# EAGLE design LB_BIT_i7-remoteTrigger_v03(2_2) (EAGLE 6.6.0)
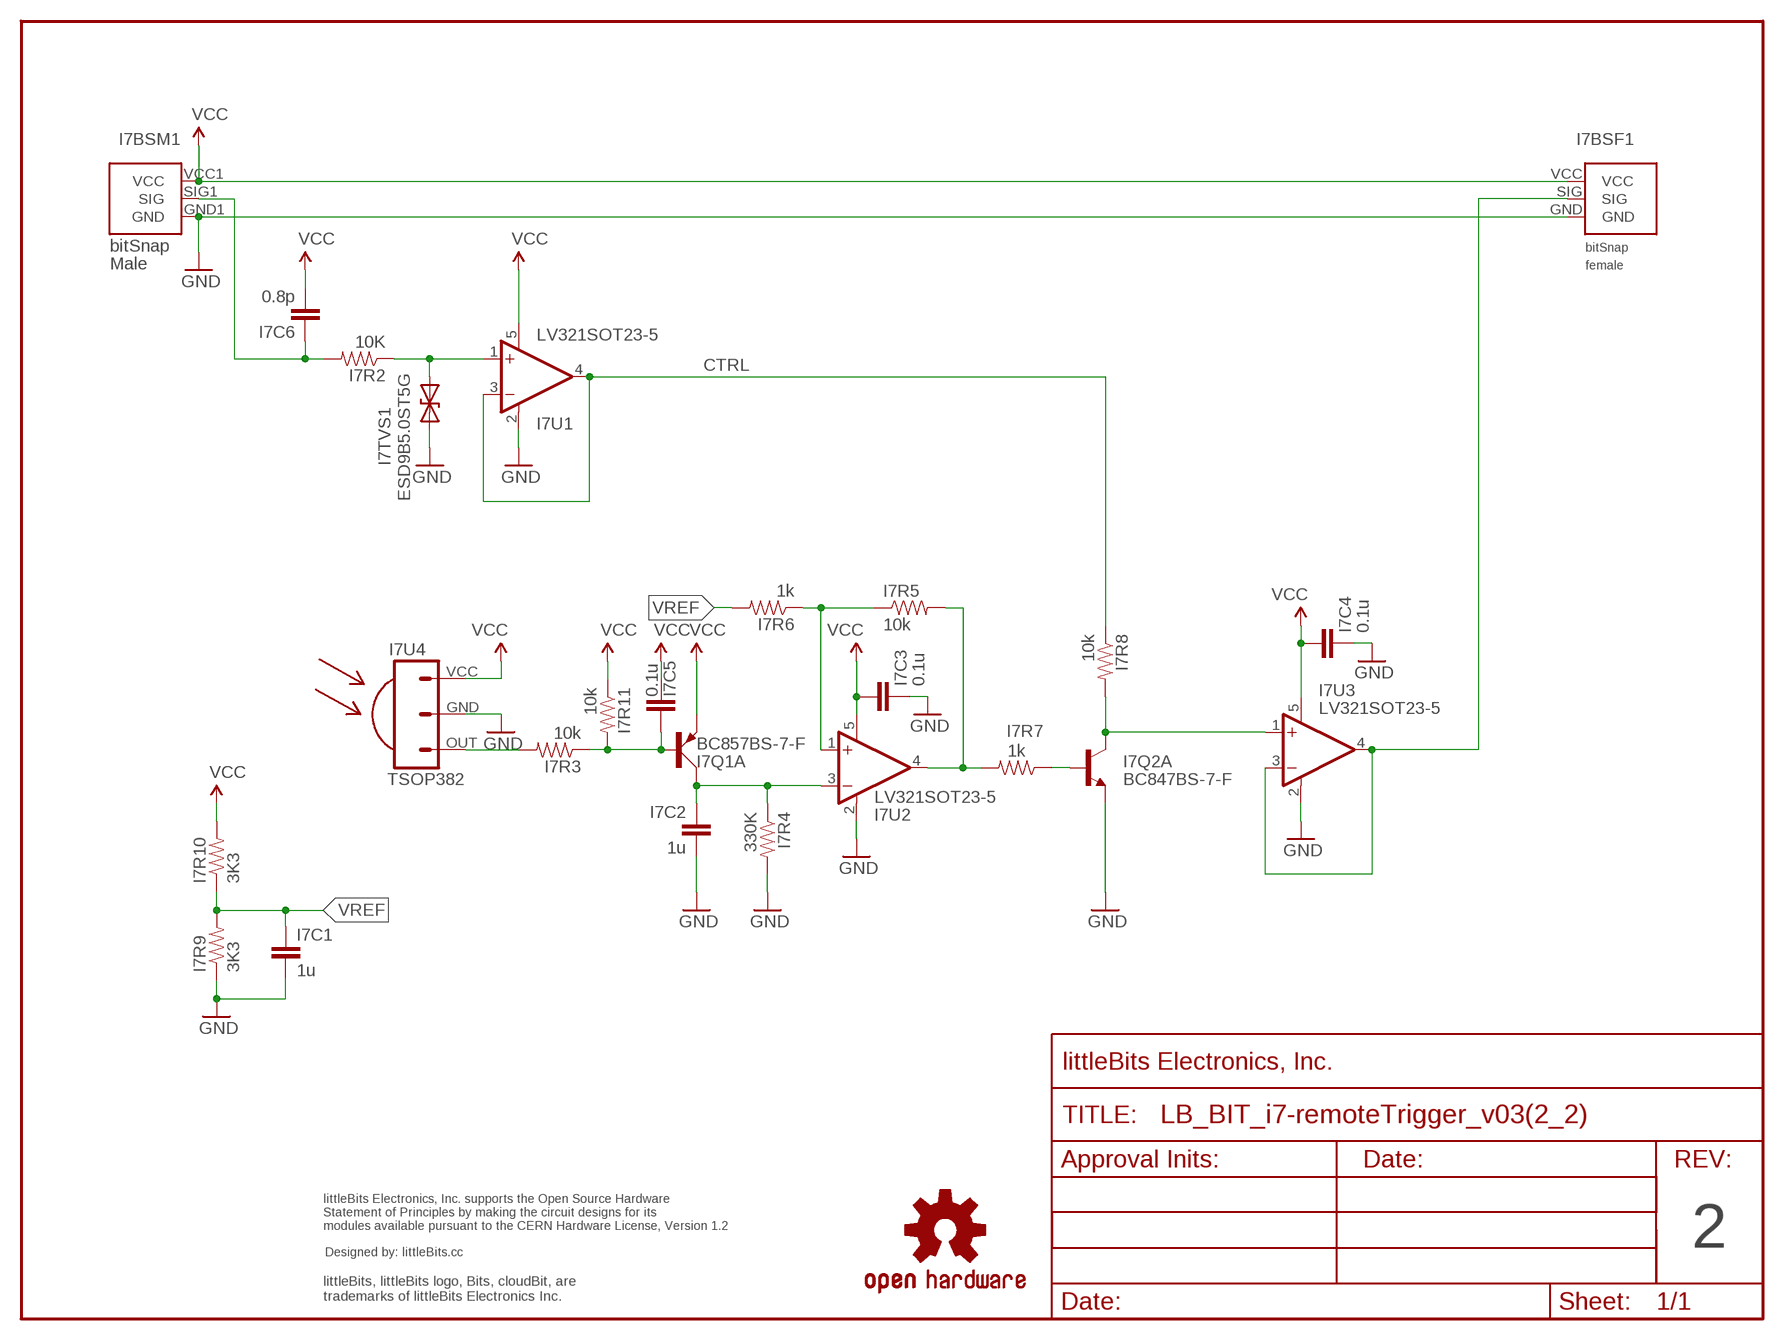
[diagram p0: schematic, sheet 1]

## Parts
I7BSF1  BITSNAP_V03_FEMALE  [BITSNAP_V03_FEMALE]
I7BSM1  BITSNAP_V03_MALE  [BITSNAP_V03_MALE]
I7C1  1u  CAPCAP-0603  [CAP-0603]
I7C2  1u  CAPCAP-0603  [CAP-0603]
I7C3  0.1u  CAPCAP-0603  [CAP-0603]
I7C4  0.1u  CAPCAP-0603  [CAP-0603]
I7C5  0.1u  CAPCAP-0603  [CAP-0603]
I7C6  0.8p  CAPCAP-0603  [CAP-0603]
I7Q1  BC857BS-7-F  TRANS-BJT_PNP-DUALBC857  [SOT-363_PHILLIPS]
I7Q2  BC847BS-7-F  TRANS-BJT_NPN-DUAL-BC847BS  [SOT-363_PHILLIPS]
I7R2  10K  RESISTOR0603  [RES-0603]
I7R3  10k  RESISTOR0603  [RES-0603]
I7R4  330K  RESISTOR0603  [RES-0603]
I7R5  10k  RESISTOR0603  [RES-0603]
I7R6  1k  RESISTOR0603  [RES-0603]
I7R7  1k  RESISTOR0603  [RES-0603]
I7R8  10k  RESISTOR0603  [RES-0603]
I7R9  3K3  RESISTOR0603  [RES-0603]
I7R10  3K3  RESISTOR0603  [RES-0603]
I7R11  10k  RESISTOR0603  [RES-0603]
I7TVS1  ESD9B5.0ST5G  DIODE-TVSSOD-923  [SOD-923]
I7U1  LV321SOT23-5  [SOT23-5]
I7U2  LV321SOT23-5  [SOT23-5]
I7U3  LV321SOT23-5  [SOT23-5]
I7U4  TSOP382  TSOP38238-IR-RECEIVER-MODULE  [IR-RECEIVER-TSOP382-THRU-HOLE]
U$2  OSHWCREDIT  [OSHWCREDIT]
U$3  OSHW-LOGOL  [OSHW-LOGO-L]
U$21  FRAME-LETTER-OHWOHW  [FABDWG01-OHW]

## Nets
CTRL: I7R8.1 I7U1.3(-IN) I7U1.4(OUT)
GND: I7BSF1.GND I7BSM1.GND1(GND) I7C1.2 I7C2.2 I7C3.1 I7C4.1 I7Q2.1(A:E) I7R4.2 I7R9.1 I7TVS1.1(A) I7U1.2(V-) I7U2.2(V-) I7U3.2(V-) I7U4.GND
N$1: I7R5.2 I7R7.2 I7U2.4(OUT)
N$2: I7C5.2 I7Q1.2(A:B) I7R3.1 I7R11.2
N$3: I7C2.1 I7Q1.6(A:C) I7R4.1 I7U2.3(-IN)
N$4: I7R5.1 I7R6.1 I7U2.1(+IN)
N$5: I7Q2.2(A:B) I7R7.1
N$6: I7R3.2 I7U4.OUT
N$7: I7Q2.6(A:C) I7R8.2 I7U3.1(+IN)
N$8: I7R2.1 I7TVS1.2(C) I7U1.1(+IN)
N$9: I7BSM1.SIG1(SIG) I7C6.1 I7R2.2
N$10: I7BSF1.SIG I7U3.3(-IN) I7U3.4(OUT)
VCC: I7BSF1.VCC I7BSM1.VCC1(VCC) I7C3.2 I7C4.2 I7C5.1 I7C6.2 I7Q1.1(A:E) I7R10.2 I7R11.1 I7U1.5(V+) I7U2.5(V+) I7U3.5(V+) I7U4.VCC
VREF: I7C1.1 I7R6.2 I7R9.2 I7R10.1
Unconnected: I7Q1.3(B:C) I7Q1.4(B:E) I7Q1.5(B:B) I7Q2.3(B:C) I7Q2.4(B:E) I7Q2.5(B:B)

## Notes on the sheet
- 2

## Library data of the parts
I7BSF1 = bitSnap:BITSNAP_V03_FEMALE
I7BSM1 = bitSnap:BITSNAP_V03_MALE
I7C1-I7C6 = LITTLEBITS:CAP
I7Q1 = LITTLEBITS:TRANS-BJT_PNP-DUAL
I7Q2 = LITTLEBITS:TRANS-BJT_NPN-DUAL
I7R2-I7R11 = LITTLEBITS:RESISTOR
I7TVS1 = LITTLEBITS:DIODE-TVS: Bidirectional Transient Voltage Suppression Diode: Device conducts in avalanche mode after reaching a part dependent voltage threshold. Used for limiting voltage spikes on ESD sensitive inputs and outputs.; IEC_ESD_PROT0: +/-18kV; LB_PN: ?; MPN: ESD9B5.0ST5G; V_CLAMP: ?; V_OPERATION: 5V
I7U1-I7U3 = LITTLEBITS:LV321
I7U4 = LITTLEBITS:TSOP38238-IR-RECEIVER-MODULE: IR receiver module from Vishay. Mfg. Part number: TSOP38238SS1V and Mouser Part number: 782-TSOP38238SS1V
U$2 = LITTLEBITS:OSHWCREDIT
U$3 = LITTLEBITS:OSHW-LOGO: Open Source Hardware Logo This logo indicates the piece of hardware it is found on incorporates a OSHW license and/or adheres to the definition of open source hardware found here: http://freedomdefined.org/OSHW
U$21 = LITTLEBITS:FRAME-LETTER-OHW

## Board
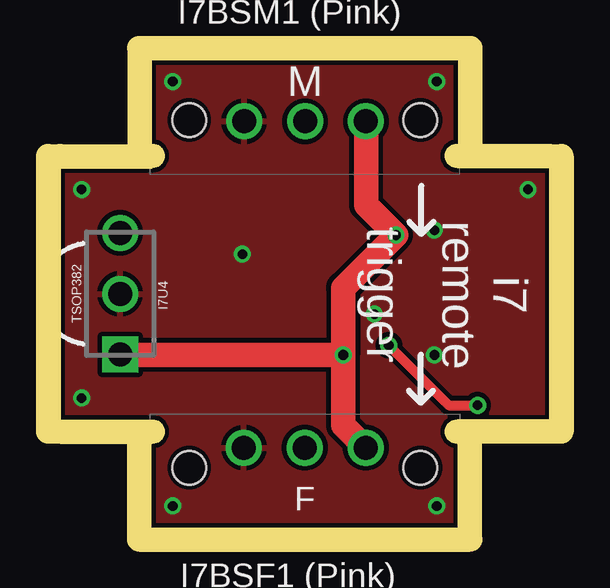
[diagram p1: board, top side]
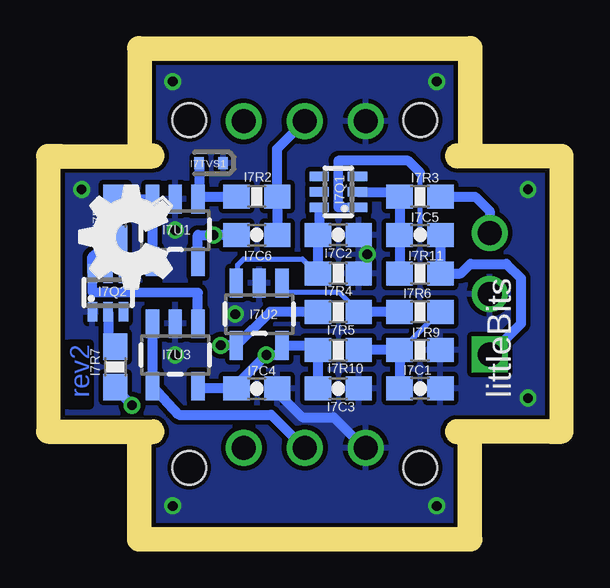
[diagram p2: board, bottom side, seen from below]

Size 20.4 x 19.5 mm. Coordinates in mm from the lower left corner, seen from the top.
Outline: 0,15 0,4.5
Outline: 20.4,4.5 20.4,15
Copper layers (1*16): Top 0.035mm / dielectric 1.5mm / Bottom 0.035mm
Design rules "littleBitsDRC": minimum track width 0.2mm, minimum drill 0.4mm, track to track 0.2mm, track to pad 0.2mm, pad to pad 0.2mm, via to via 0.2mm, smd to smd 0mil, copper to edge 0.2mm, drill to drill 0.2mm, minimum pad ring 0.2mm, minimum via ring 0.15mm, stop-mask expansion 0.1mm, vias tented up to drill 0mil, thermal gap 0.2mm
Milling: 6 lines

### Footprints (pad centres in the part's own frame; a part is rotated, then mirrored left to right if it is on the bottom)
BITSNAP_V03_FEMALE = drill 1: GND 3.91,3.33; SIG 6.45,3.33; VCC 8.99,3.33 | hole 1.4: 1.63,2.5; 11.27,2.5
BITSNAP_V03_MALE = drill 1: GND1 8.98,2.56; SIG1 6.44,2.56; VCC1 3.9,2.56 | hole 1.4: 11.27,2.5; 1.63,2.5
CAP-0603 = smd 1.1 x 1: 1 -0.85,0; 2 0.85,0
SOT-363_PHILLIPS = smd 0.4 x 0.8: 1 -0.65,-0.8; 2 0,-0.8; 3 0.65,-0.8; 4 0.65,0.8; 5 0,0.8; 6 -0.65,0.8
RES-0603 = smd 1.1 x 1: 1 -0.85,0; 2 0.85,0
SOD-923 = smd 0.4 x 0.5: 1 -0.5,0; 2 0.5,0
SOT23-5 = smd 0.55 x 1.2: 1 -0.95,-1.3; 2 0,-1.3; 3 0.95,-1.3; 4 0.95,1.3; 5 -0.95,1.3
IR-RECEIVER-TSOP382-THRU-HOLE = drill 1: GND 0,0; OUT 2.54,0 | drill 1 square: VCC -2.54,0

### Placement (x,y rotation side)
I7BSF1  3.75,0 0 top
I7BSM1  16.65,19.5 180 top
I7C1  5.4,5.8 0 bottom
I7C2  8.8,12.2 0 bottom
I7C3  8.8,5.8 180 bottom
I7C4  12.2,5.8 180 bottom
I7C5  5.4,12.2 180 bottom
I7C6  12.2,12.2 180 bottom
I7Q1  8.8,14 90 bottom
I7Q2  18.4,9.8 0 bottom
I7R2  12.2,13.8 0 bottom
I7R3  5.4,13.8 0 bottom
I7R4  8.8,10.6 0 bottom
I7R5  8.8,9 180 bottom
I7R6  5.4,9 0 bottom
I7R7  18.1,6.7 270 bottom
I7R8  18.1,12.9 270 bottom
I7R9  5.4,7.4 180 bottom
I7R10  8.8,7.4 180 bottom
I7R11  5.4,10.6 180 bottom
I7TVS1  14.1,15.2 180 bottom
I7U1  15.6,12.4 180 bottom
I7U2  12.1,8.9 180 bottom
I7U3  15.6,7.2 180 bottom
I7U4  2.5,9.75 90 top
U$2  -91.7,-64.6 0 top  (outside the outline)
U$3  -25.1,-70.9 0 top  (outside the outline)
U$6  [OSHW_FILLX150_NOTEXT]  15.76,9.16 0 top
U$21  0,0 0 top

### Tracks (layer width: path | path; a pad name or v marks a point on that pad's centre or on a via)
CTRL
  Bottom 0.406: I7U1.4 I7U1.3 18.05,13.7 I7R8.1
GND  (via drill 0.41)
  Bottom 0.406: I7C4.1 11.2,5.65 11.3,5.6 10.3,4.6 9,4.6 7.73,3.33 I7BSF1.GND | I7R4.2 7.6,10.95 v7.6,11.4
  other vias: 13.1,8.9 15.6,7.2 15.6,12.4 4.7,0.9 15.7,0.9 15.7,18.6 4.7,18.6 0.9,14.1 0.9,5.4 19.5,14.1
  pour Top: 0.1,19.42 0.1,0.15 20.27,0.15 20.27,19.42
  pour Bottom: 0.1,19.4 20.25,19.4 20.25,0.1 0.1,0.1
N$1  (via drill 0.41)
  Top 0.406: v13.7,7.6 16.2,5.1 v17.4,5.1
  Bottom 0.406: I7R5.2 11.65,9 I7U2.4 v13.7,7.6 | v17.4,5.1 18.1,5.8 I7R7.2
N$2
  Bottom 0.406: I7R11.2 I7C5.2 I7R3.1 6.25,14 I7Q1.2
N$3
  Bottom 0.203: I7U2.3 13,10.5 13,10.95 12.75,11.2 10.3,11.2 9.7,10.6
  Bottom 0.406: I7Q1.6 9.6,12.35 I7C2.1 I7R4.1 9.7,10.6
N$4
  Bottom 0.2: I7R5.1 8.75,9.8 11.1,9.8
  Bottom 0.203: 11.1,9.8 11.1,10.2
  Bottom 0.406: I7R6.1 I7R5.1 | 11.1,10.2 I7U2.1
N$5
  Bottom 0.406: I7Q2.2 18.4,7.85 I7R7.1
N$6
  Bottom 0.406: I7R3.2 3.1,13.8 2.5,13.2 I7U4.OUT
N$7
  Bottom 0.4: 14.65,9.8 19,9.8 arc90 19.05,9.85 I7Q2.6
  Bottom 0.406: I7Q2.6 19.05,11.3 I7R8.2 | I7U3.1 14.65,9.8
N$8
  Bottom 0.406: I7R2.1 14.55,13.8 I7U1.1 arc-90 14.6,13.75 I7TVS1.2
N$9
  Bottom 0.406: I7C6.1 I7R2.2 11.35,15.8 I7BSM1.SIG1
N$10
  Bottom 0.406: I7U3.3 I7U3.4 15.45,4.7 11.6,4.7 10.3,3.4 I7BSF1.SIG
VCC  (via drill 0.41)
  Top 0.406: I7U4.VCC
  Top 1.016: I7BSM1.VCC1 12.75,13.45 v14,12.2 11.8,10 v11.8,7.2 | I7BSF1.VCC 11.8,4.27 v11.8,7.2 | v11.8,7.2 I7U4.VCC
  Bottom 0.2: I7C5.1 5.4,12.2 5.4,14.8
  Bottom 0.4: 8.8,15.3 8.8,13.35 I7Q1.1
  Bottom 0.406: I7C3.2 I7R10.2 9.85,7.6 I7U2.5 11.15,7.2 v11.8,7.2 13.05,5.95 I7C4.2 14.65,5.8 I7U3.5 | I7C5.1 I7R11.1 3.7,10.6 3.3,11 1.8,11 1.2,10.4 1.2,8.5 I7U4.VCC | I7C6.2 v14,12.2 14.65,12.2 I7U1.5 | 5.4,14.8 5.9,15.3 8.8,15.3
VREF
  Bottom 0.203: I7R6.2 4.83,8.77 6.1,7.5 6.15,7.5 I7R9.2
  Bottom 0.406: I7C1.1 I7R9.2 I7R10.1

### Text on the board
Bottom: rev2
tPlace: trigger | i7 / remote
bPlace: littleBits
tNames: I7BSM1 (Pink) | I7BSF1 (Pink)
Milling: 1mm DIA. ROUTER PATH
Reference: SMALL
dxf: 2 | Remote IR Trigger Bit